# EAGLE design Slew and Hold v1 (EAGLE 7.7.0)
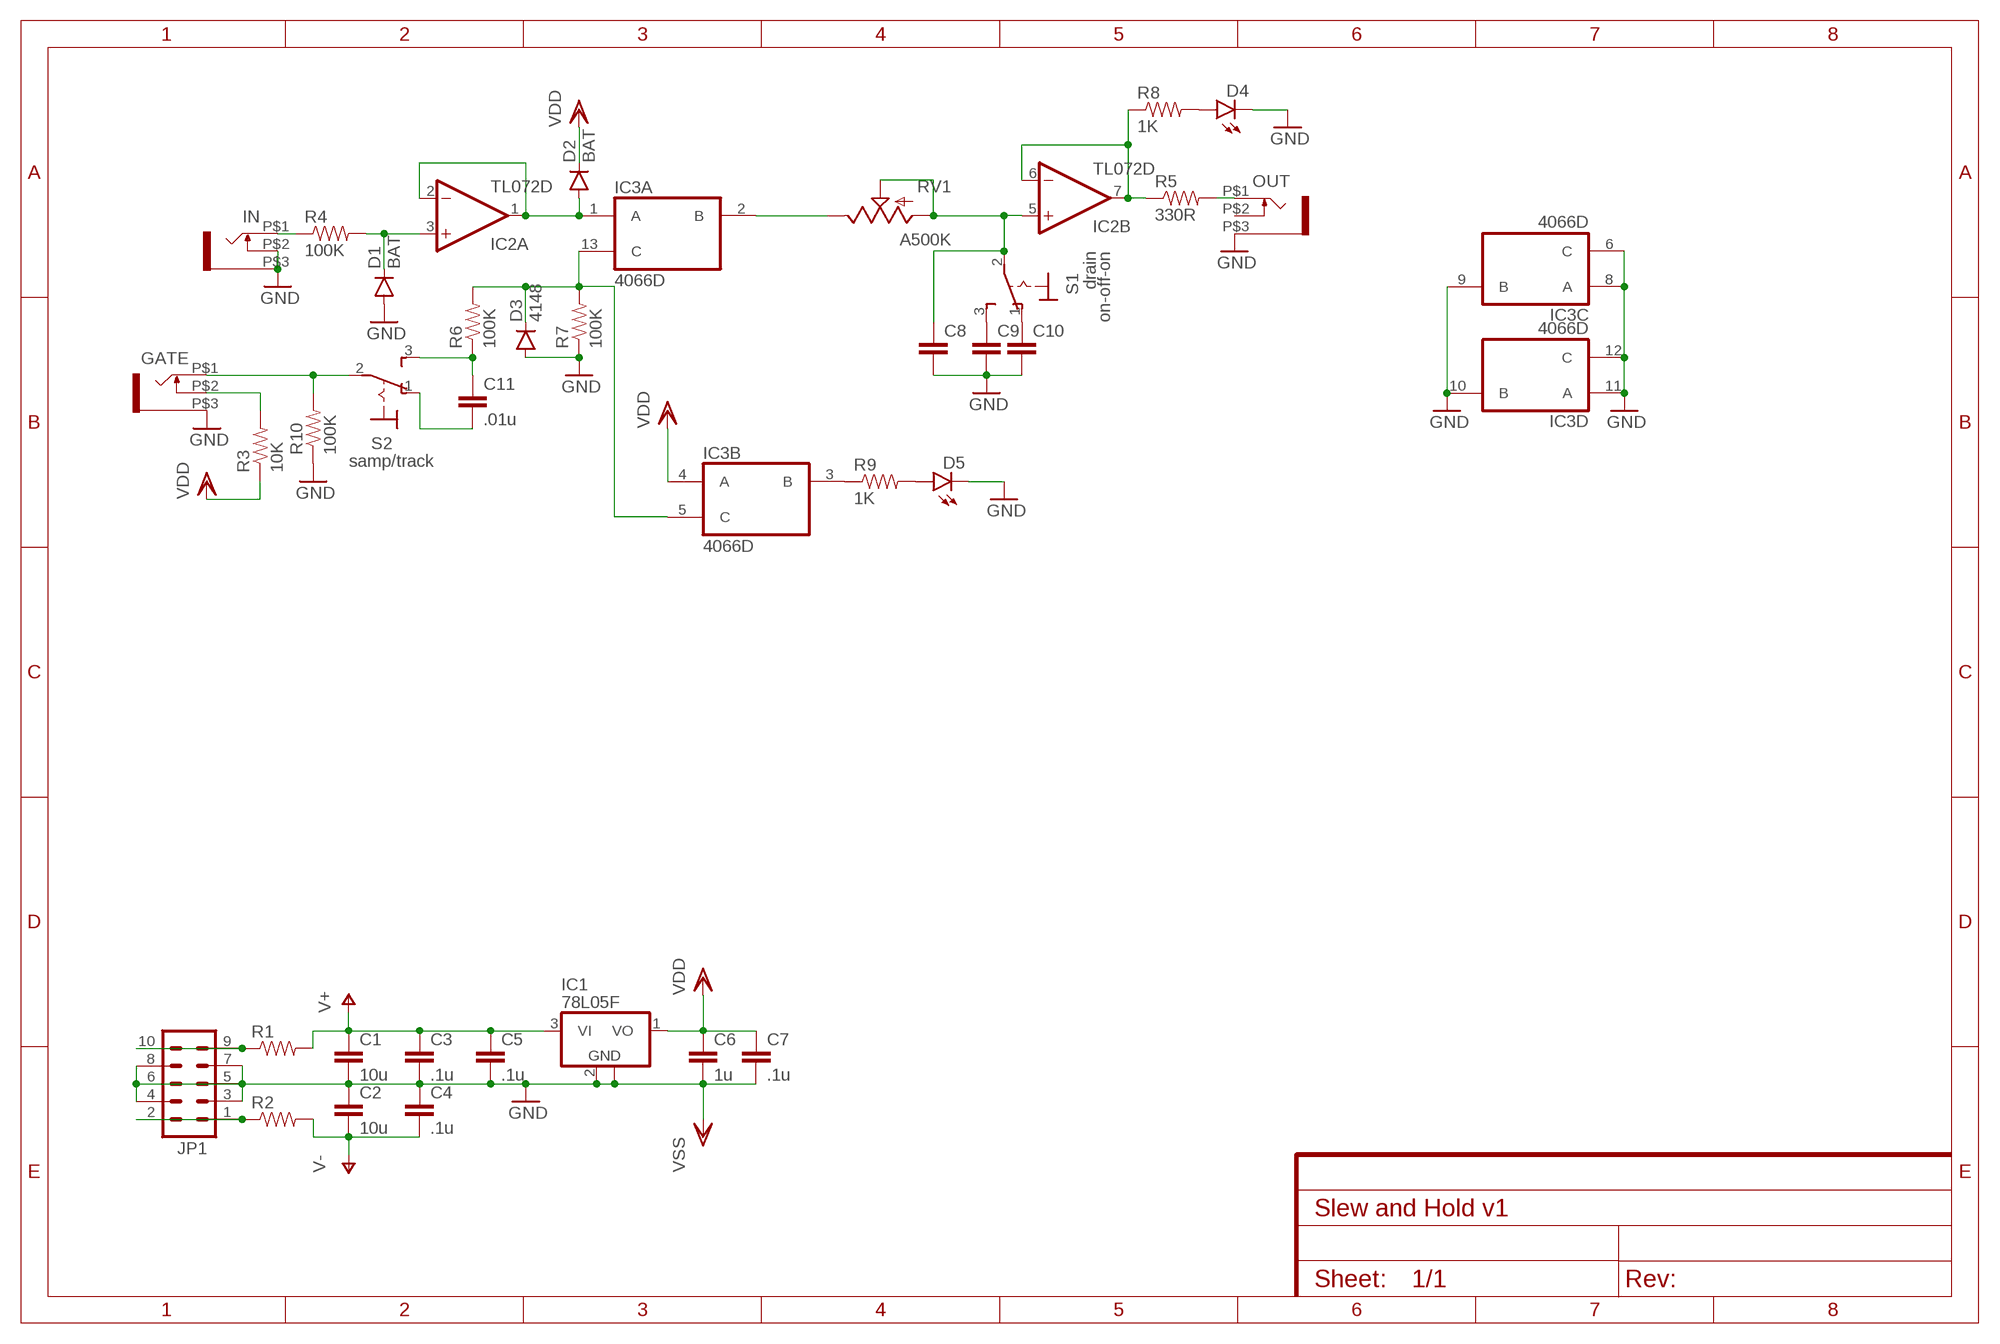
[diagram p0: schematic, sheet 1]

## Parts
C1  10u  CAP1206  [1206]
C2  10u  CAP1206  [1206]
C3  .1u  CAP0805  [0805]
C4  .1u  CAP0805  [0805]
C5  .1u  CAP0805  [0805]
C6  1u  CAP0805  [0805]
C7  .1u  CAP0805  [0805]
C8  CAP0805  [0805]
C9  CAP0805  [0805]
C10  CAP0805  [0805]
C11  .01u  CAP0805  [0805]
D1  BAT  DIODESOD123  [SOD-123]
D2  BAT  DIODESOD123  [SOD-123]
D3  4148  DIODESOD123  [SOD-123]
D4  LED3MM  [LED3MM]
D5  LED3MM  [LED3MM]
GATE  WQP-PJ301M-12_JACK  [WQP-PJ301M-12_JACK]
IC1  78L05F  [SOT89]
IC2  TL072D  [SO08]
IC3  4066D  [SO14]
IN  WQP-PJ301M-12_JACK  [WQP-PJ301M-12_JACK]
JP1  M05X2PTH  [AVR_ICSP]
OUT  WQP-PJ301M-12_JACK  [WQP-PJ301M-12_JACK]
R1  RESISTOR0805-RES  [0805]
R2  RESISTOR0805-RES  [0805]
R3  10K  RESISTOR0805-RES  [0805]
R4  100K  RESISTOR0805-RES  [0805]
R5  330R  RESISTOR0805-RES  [0805]
R6  100K  RESISTOR0805-RES  [0805]
R7  100K  RESISTOR0805-RES  [0805]
R8  1K  RESISTOR0805-RES  [0805]
R9  1K  RESISTOR0805-RES  [0805]
R10  100K  RESISTOR0805-RES  [0805]
RV1  A500K  POT  [ALPS_POT]
S1  drain  M9040P  [M9040P]
S2  samp/track  M9040P  [M9040P]

## Nets
GND: C1.2 C2.1 C3.2 C4.1 C5.2 C6.2 C7.2 C8.2 C9.2 C10.2 D1.A D3.A D4.K(C) D5.K(C) GATE.P$3 IC1.2(GND) IC1.2@1(GND) IC3.6(C:C) IC3.8(C:A) IC3.9(C:B) IC3.10(D:B) IC3.11(D:A) IC3.12(D:C) IN.P$2 IN.P$3 JP1.3 JP1.4 JP1.5 JP1.6 JP1.7 JP1.8 OUT.P$3 R7.1 R10.1 ; supply symbol labelled VSS
N$1: JP1.9 JP1.10 R1.1
N$2: JP1.1 JP1.2 R2.1
N$3: D2.A IC2.1(A:OUT) IC2.2(A:-IN) IC3.1(A:A)
N$4: D1.C IC2.3(A:+IN) R4.2
N$5: IN.P$1 R4.1
N$6: IC3.2(A:B) RV1.P$1(E)
N$7: C8.1 IC2.5(B:+IN) RV1.P$2(S) RV1.P$3(A) S1.2(P)
N$8: C9.1 S1.3(S)
N$9: C10.1 S1.1(O)
N$10: D4.A R8.2
N$11: IC2.6(B:-IN) IC2.7(B:OUT) R5.1 R8.1
N$12: GATE.P$1 R10.2 S2.2(P)
N$13: D3.C IC3.5(B:C) IC3.13(A:C) R6.2 R7.2
N$14: GATE.P$2 R3.2
N$15: OUT.P$1 R5.2
N$16: C11.1 R6.1 S2.3(S)
N$17: C11.2 S2.1(O)
N$20: IC3.3(B:B) R9.1
N$21: D5.A R9.2
V+: C1.1 C3.1 C5.1 IC1.3(VI) R1.2
V-: C2.2 C4.2 R2.2
VDD: C6.1 C7.1 D2.C IC1.1(VO) IC3.4(B:A) R3.1
Unconnected: OUT.P$2

## Notes on the sheet
- on-off-on

## Power pins joined to a net without a drawn wire
GND: IC3.7(P:VSS)
V+: IC2.8(P:V+)
V-: IC2.4(P:V-)
VDD: IC3.14(P:VDD)

## Library data of the parts
C1-C11 = SparkFun-Capacitors:CAP: Capacitor Standard 0603 ceramic capacitor, and 0.1" leaded capacitor.
D1-D3 = SparkFun-DiscreteSemi:DIODE: Diode These are standard reverse protection diodes and small signal diodes. SMA package can handle up to about 1A. SOD-323 can handle about 200mA. What the SOD-323 package when ordering, there are some mfgs out there that are 5-pin packages.
D4 D5 = SparkFun-LED:LED: LEDs Standard schematic elements and footprints for 5mm, 3mm, 1206, and 0603 sized LEDs. 5mm - Spark Fun Electronics SKU : COM-00529 (and others)
GATE IN OUT = thonkiconn:WQP-PJ301M-12_JACK
IC1 = linear:78L*: POSITOIV-VOLTAGE REGULATORS Output up to 100 mA Source: Datasheet <http://focus.ti.com/lit/ds/symlink/ua78l05.pdf>
IC2 = linear:TL072: OP AMP
IC3 = 40xx:4066: Quad bilateral ANALOG SWITCH
JP1 = SparkFun-Connectors:M05X2: Header 5x2 Standard 10-pin dual row 0.1" header. Commonly used with AVR-ISP. Use with Spark Fun Electronics SKU: PRT-00778
R1-R10 = SparkFun-Resistors:RESISTOR: Resistor Basic schematic elements and footprints for 0603, 1206, and PTH resistors.
RV1 = SparkFun-Electromechanical:POT; PROD_ID: RES-09177
S1 S2 = switch:M9040P: TOGGLE SWITCH Marquardt

## Board
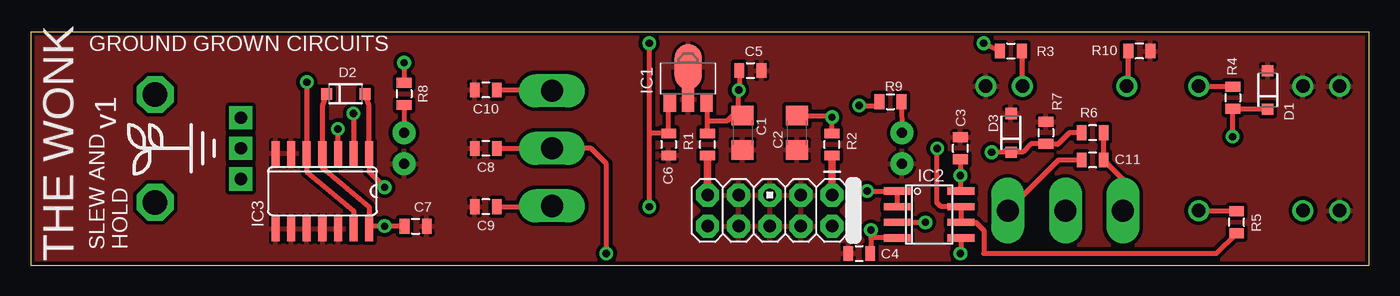
[diagram p1: board, top side]
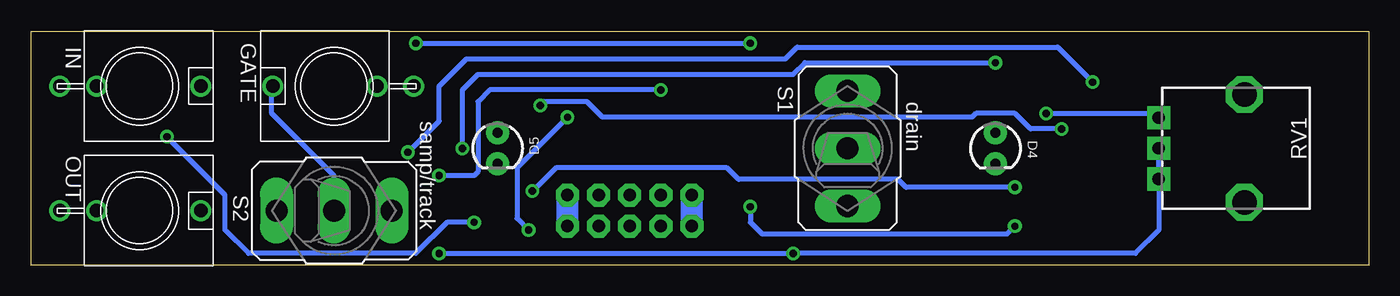
[diagram p2: board, bottom side, seen from below]

Size 109.22 x 19.05 mm. Coordinates in mm from the lower left corner, seen from the top.
Outline: 0,0 109.22,0 109.22,19.05 0,19.05 0,0
Copper layers (1*16): Top 0.035mm / dielectric 1.5mm / Bottom 0.035mm
Design rules "SparkFun": minimum track width 8mil, minimum drill 20mil, track to track 8mil, track to pad 8mil, pad to pad 8mil, via to via 8mil, smd to smd 8mil, copper to edge 8mil, drill to drill 8mil, minimum pad ring 12mil, minimum via ring 10mil, stop-mask expansion 4mil, vias tented up to drill 20mil, thermal gap 10mil

### Footprints (pad centres in the part's own frame; a part is rotated, then mirrored left to right if it is on the bottom)
1206 = smd 1.6 x 1.8: 1 -1.4,0; 2 1.4,0
0805 = smd 0.8 x 1.2: 1 -0.9,0; 2 0.9,0
SOD-123 = smd 0.9 x 0.95: A 1.575,0; C -1.575,0
LED3MM = drill 0.813 pad 1.88: A -1.27,0; K 1.27,0
WQP-PJ301M-12_JACK = drill 1.1: P$1 0,5; P$2 0,-3.5; P$3 0,-6.5
SOT89 = smd 1 x 1.5: 1 -1.499,-1.981; 3 1.499,-1.981 | smd 1 x 2: 2 0,-1.727 | smd 2.2 x 3.7: 2@1 0,0.94
SO08 = smd 0.6 x 2.2: 1 -1.905,-2.6; 2 -0.635,-2.6; 3 0.635,-2.6; 4 1.905,-2.6; 5 1.905,2.6; 6 0.635,2.6; 7 -0.635,2.6; 8 -1.905,2.6
SO14 = smd 0.66 x 2.032: 1 -3.81,-3.073; 2 -2.54,-3.073; 3 -1.27,-3.073; 4 0,-3.073; 5 1.27,-3.073; 6 2.54,-3.073; 7 3.81,-3.073; 8 3.81,3.073; 9 2.54,3.073; 10 1.27,3.073; 11 0,3.073; 12 -1.27,3.073; 13 -2.54,3.073; 14 -3.81,3.073
AVR_ICSP = drill 1.016 pad 1.88 octagon: 1 -1.27,5.08; 2 1.27,5.08; 3 -1.27,2.54; 4 1.27,2.54; 5 -1.27,0; 6 1.27,0; 7 -1.27,-2.54; 8 1.27,-2.54; 9 -1.27,-5.08; 10 1.27,-5.08
ALPS_POT = drill 1 pad 1.88 square: P$1 7,-2.5; P$2 7,0; P$3 7,2.5 | drill 2 octagon: P$4 0,-4.4; P$5 0,4.4
M9040P = drill 1.803 long: 1 0,4.699; 2 0,0; 3 0,-4.699

### Placement (x,y rotation side)
C1  58.1,10.79 270 top
C2  62.55,10.79 90 top
C3  75.88,9.53 90 top
C4  67.63,0.95 0 top
C5  58.74,15.88 0 top
C6  52.07,9.84 270 top
C7  31.43,3.17 0 top
C8  37.15,9.53 180 top
C9  37.15,4.76 180 top
C10  37.15,14.29 180 top
C11  86.68,8.57 180 top
D1  100.97,14.29 90 top
D2  25.72,13.97 0 top
D3  80.01,10.79 90 top
D4  30.48,9.53 270 bottom
D5  71.12,9.53 270 bottom
GATE  84.45,14.61 90 bottom
IC1  53.66,15.24 0 top
IC2  73.34,4.13 270 top
IC3  23.81,6.03 180 top
IN  100.33,14.61 270 bottom
JP1  60.33,4.45 270 top
OUT  100.33,4.45 270 bottom
R1  55.24,9.84 90 top
R2  65.41,9.84 90 top
R3  80.01,17.46 0 top
R4  98.11,13.65 270 top
R5  98.42,3.49 90 top
R6  86.68,10.79 180 top
R7  82.87,10.79 270 top
R8  30.48,13.97 270 top
R9  70.17,13.34 0 top
R10  90.49,17.46 180 top
RV1  10.16,9.53 180 bottom
S1  42.55,9.53 0 bottom
S2  84.45,4.45 270 bottom
U$1  [LOGO_SMALL]  13.02,9.53 90 top

### Tracks (layer width: path | path; a pad name or v marks a point on that pad's centre or on a via)
GND
  pour Top (isolate 0.305): 0,0 109.22,0 109.22,19.05 0,19.05
N$1
  Top 0.61: R1.1 JP1.9
  Bottom 1.778: JP1.10 JP1.9
N$2
  Top 0.61: R2.1 JP1.1
  Bottom 1.778: JP1.2 JP1.1
N$3  (via drill 0.6)
  Top 0.406: D2.A 27.62,13.01 IC3.1 27.62,7.62 v28.89,6.35 | IC2.2 IC2.1 v68.26,6.03
  Bottom 0.406: v28.89,6.35 37.78,6.35 38.42,6.99 51.44,6.99 52.39,7.94 66.36,7.94 v68.26,6.03
N$4  (via drill 0.6)
  Top 0.406: D1.C 100.92,12.75 R4.2 v98.11,10.48 | IC2.3 v73.03,3.49
  Bottom 0.406: v73.03,3.49 75.25,3.49 77.79,0.95 91.44,0.95 93.34,2.86 93.34,5.71 v98.11,10.48
N$5
  Top 0.406: IN.P$1 98.06,14.61 R4.1
N$6  (via drill 0.6)
  Top 0.406: v26.35,12.38 IC3.2
  Bottom 0.406: v26.35,12.38 17.52,12.38 RV1.P$1
N$7  (via drill 0.6)
  Top 0.406: C8.1 S1.2 45.72,9.53 46.99,8.26 v46.99,0.95 | IC2.5 75.94,1.01 v75.88,0.95
  Bottom 0.406: v75.88,0.95 v46.99,0.95 19.05,0.95 17.16,2.84 RV1.P$3 RV1.P$2
N$8
  Top 0.406: C9.1 42.48,4.76 S1.3
N$9
  Top 0.406: C10.1 42.48,14.29 S1.1
N$10
  Top 0.406: R8.2 D4.A
N$11  (via drill 0.6)
  Top 0.406: R5.1 96.78,0.95 77.79,0.95 77.79,2.86 77.15,3.49 IC2.6 IC2.7 74.3,4.76 73.98,5.08 v73.98,9.53 | v30.48,16.51 R8.1
  Bottom 0.406: v73.98,9.53 73.98,14.29 72.71,15.56 46.99,15.56 46.04,16.51 v30.48,16.51
N$12
  Top 0.406: GATE.P$1 89.59,14.61 R10.2
  Bottom 0.406: S2.2 84.45,7.3 89.53,12.38 89.53,14.53 GATE.P$1
N$13  (via drill 0.6)
  Top 0.406: IC3.13 26.35,4.45 22.54,7.62 IC3.5 v22.54,14.92 | R6.2 84.77,10.79 83.82,9.84 82.92,9.84 R7.2 81.65,9.89 80.96,9.21 80.02,9.21 D3.C 78.44,9.22 v78.42,9.21
  Bottom 0.406: v78.42,9.21 75.88,11.75 75.88,14.61 73.66,16.83 47.62,16.83 46.67,17.78 25.4,17.78 v22.54,14.92
N$14
  Top 0.406: R3.2 80.91,14.65 GATE.P$2
N$15
  Top 0.406: R5.2 95.38,4.39 OUT.P$1
N$16
  Top 0.406: S2.3 89.15,7 C11.1 R6.1
N$17
  Top 0.406: C11.2 83.88,8.57 S2.1
N$20  (via drill 0.6)
  Top 0.406: IC3.3 v25.08,11.11 | v67.63,13.02 68.95,13.02 R9.1
  Bottom 0.406: v25.08,11.11 27.62,11.11 28.89,12.38 32.07,12.38 32.38,12.06 62.55,12.06 63.82,13.34 67.31,13.34 v67.63,13.02
N$21
  Top 0.406: R9.2 D5.A
V+  (via drill 0.6)
  Top 0.406: R1.2 55.24,11.75 | 55.24,11.75 55.24,13.17 IC1.3 | 55.24,11.75 56.83,11.75 57.28,12.2 C1.1 57.78,12.51 v57.78,14.29 57.84,14.34 C5.1 | IC2.8 75.88,6.09 v75.88,7.3 C3.1
  Bottom 0.406: v57.78,14.29 71.75,14.29 72.71,13.34 72.71,7.62 73.03,7.3 v75.88,7.3
V-  (via drill 0.6)
  Top 0.406: C2.2 65.28,12.2 v65.41,12.06 R2.2 | v68.58,2.86 68.58,2.22 | 68.58,2.22 68.58,1 C4.2 | IC2.4 68.58,2.22
  Bottom 0.406: v65.41,12.06 69.53,7.94 69.53,3.81 v68.58,2.86
VDD  (via drill 0.6)
  Top 0.406: IC1.1 52.07,13.17 C6.1 50.53,10.74 50.48,10.79 | D2.C 23.81,13.01 IC3.4 23.81,7.94 27.62,4.76 IC3.14 27.84,3.17 v28.89,3.17 C7.1 | R3.1 v77.79,18.1 | v50.48,18.1 50.48,10.79 | 50.48,10.79 v50.48,4.76
  Bottom 0.406: v28.89,3.17 29.53,2.54 49.53,2.54 50.48,3.49 v50.48,4.76 | v77.79,18.1 v50.48,18.1

### Text on the board
tPlace: GROUND GROWN CIRCUITS | v1 | SLEW AND / HOLD | THE WONK